# Altium project Inteligent_IGBT.PrjPcb
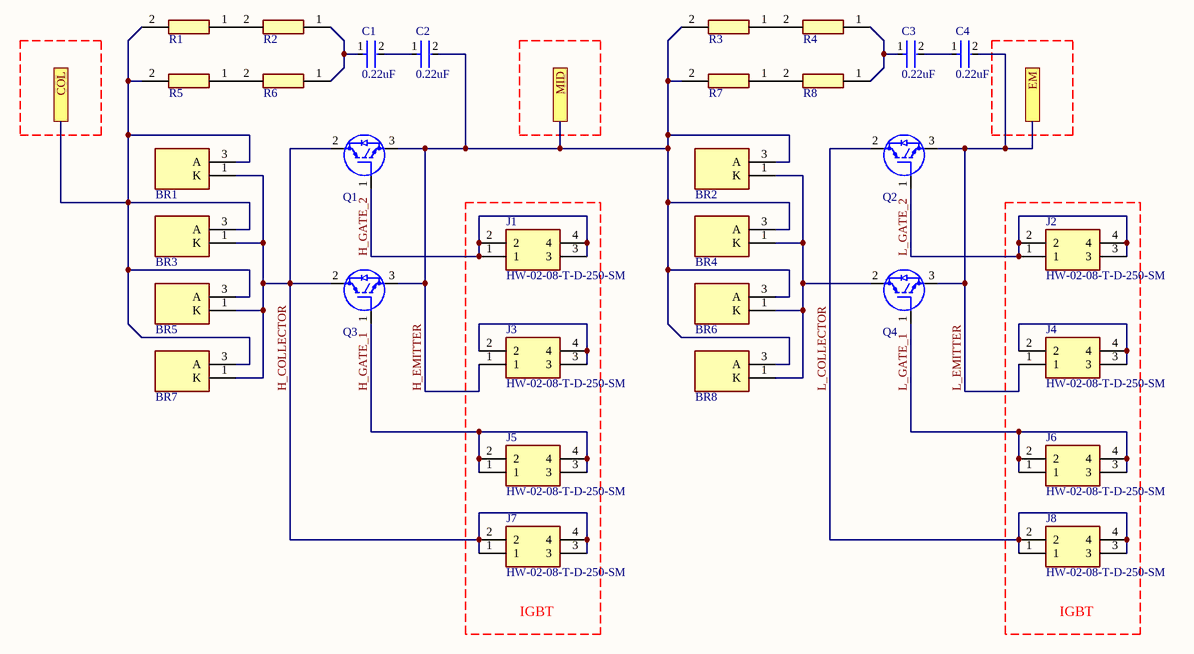
[diagram p0: Inteligent_IGBT.SchDoc]
1 sheet, 32 parts. Net scope: flat (ports and power ports of the same name join across sheets).
Board file: Inteligent_IGBT.PcbDoc

## Sheet Inteligent_IGBT.SchDoc
size A4

### Parts
BR1  VS-75EPU12L-N3  [VS-75EPU12L-N3]  (value not drawn)
BR2  VS-75EPU12L-N3  [VS-75EPU12L-N3]  (value not drawn)
BR3  VS-75EPU12L-N3  [VS-75EPU12L-N3]  (value not drawn)
BR4  VS-75EPU12L-N3  [VS-75EPU12L-N3]  (value not drawn)
BR5  VS-75EPU12L-N3  [VS-75EPU12L-N3]  (value not drawn)
BR6  VS-75EPU12L-N3  [VS-75EPU12L-N3]  (value not drawn)
BR7  VS-75EPU12L-N3  [VS-75EPU12L-N3]  (value not drawn)
BR8  VS-75EPU12L-N3  [VS-75EPU12L-N3]  (value not drawn)
C1  0.22uF  [FP-CKC33C-IPC_A]
C2  0.22uF  [FP-CKC33C-IPC_A]
C3  0.22uF  [FP-CKC33C-IPC_A]
C4  0.22uF  [FP-CKC33C-IPC_A]
J1  HW-02-08-T-D-250-SM  [HW0208TD250SM]
J2  HW-02-08-T-D-250-SM  [HW0208TD250SM]
J3  HW-02-08-T-D-250-SM  [HW0208TD250SM]
J4  HW-02-08-T-D-250-SM  [HW0208TD250SM]
J5  HW-02-08-T-D-250-SM  [HW0208TD250SM]
J6  HW-02-08-T-D-250-SM  [HW0208TD250SM]
J7  HW-02-08-T-D-250-SM  [HW0208TD250SM]
J8  HW-02-08-T-D-250-SM  [HW0208TD250SM]
Q1  IXYK110N120A4  [IXYK110N120A4]  (value not drawn)
Q2  IXYK110N120A4  [IXYK110N120A4]  (value not drawn)
Q3  IXYK110N120A4  [IXYK110N120A4]  (value not drawn)
Q4  IXYK110N120A4  [IXYK110N120A4]  (value not drawn)
R1  RCL12251K00FKEG  [RESC3263X80N]  (value not drawn)
R2  RCL12251K00FKEG  [RESC3263X80N]  (value not drawn)
R3  RCL12251K00FKEG  [RESC3263X80N]  (value not drawn)
R4  RCL12251K00FKEG  [RESC3263X80N]  (value not drawn)
R5  RCL12251K00FKEG  [RESC3263X80N]  (value not drawn)
R6  RCL12251K00FKEG  [RESC3263X80N]  (value not drawn)
R7  RCL12251K00FKEG  [RESC3263X80N]  (value not drawn)
R8  RCL12251K00FKEG  [RESC3263X80N]  (value not drawn)

### Blocks framed on the sheet
IGBT: J1 J3 J5 J7
IGBT: J2 J4 J6 J8

### Ports
COL, EM, MID

### Nets
H_COLLECTOR: BR1.1(K) BR3.1(K) BR5.1(K) BR7.1(K) J7.1 J7.2 J7.3 J7.4 Q1.2(C) Q3.2(C)
H_EMITTER: BR2.3(A) BR4.3(A) BR6.3(A) BR8.3(A) C2.2 J3.1 Q1.3(E) Q3.3(E) R3.2 R7.2 ; port MID
H_GATE_1: J5.1 J5.2 J5.3 J5.4 Q3.1(G)
H_GATE_2: J1.1 J1.2 J1.3 J1.4 Q1.1(G)
L_COLLECTOR: J8.1 J8.2 J8.3 J8.4 Q2.2(C)
L_EMITTER: C4.2 J4.1 Q2.3(E) Q4.3(E) ; port EM
L_GATE_1: J6.1 J6.2 J6.3 J6.4 Q4.1(G)
L_GATE_2: J2.1 J2.2 J2.3 J2.4 Q2.1(G)
NetBR1_3: BR1.3(A) BR3.3(A) BR5.3(A) BR7.3(A) R1.2 R5.2 ; port COL
NetBR2_1: BR2.1(K) BR4.1(K) BR6.1(K) BR8.1(K) Q4.2(C)
NetC1_1: C1.1 R2.1 R6.1
NetC1_2: C1.2 C2.1
NetC3_1: C3.1 R4.1 R8.1
NetC3_2: C3.2 C4.1
NetJ3_2: J3.2 J3.3 J3.4
NetJ4_2: J4.2 J4.3 J4.4
NetR1_1: R1.1 R2.2
NetR3_1: R3.1 R4.2
NetR5_1: R5.1 R6.2
NetR7_1: R7.1 R8.2

### Library data of the parts
BR1-BR8 = VS-75EPU12L-N3: Bridge Rectifier; Manufacturer_Name: Vishay; Datasheet Link: https://datasheet.lcsc.com/szlcsc/1811271814_Vishay-Intertech-VS-75EPU12L-N3_C335787.pdf; Height: 24.99mm; Manufacturer_Part_Number: VS-75EPU12L-N3; Mouser Part Number: 78-VS-75EPU12L-N3; Mouser Price/Stock: https://www.mouser.co.uk/ProductDetail/Vishay-Semiconductors/VS-75EPU12L-N3?qs=AfeIN4OqR0CECNyPZBJseQ%3D%3D; Arrow Part Number: VS-75EPU12L-N3; Arrow Price/Stock: https://www.arrow.com/en/products/vs-75epu12l-n3/vishay
C1-C4 = CMP-03020-010018-1: KC-LINK 3640 220NF 500V C0G; Manufacturer: KEMET; Manufacturer Part Number: CKC33C224KCGACAUTO; Material: Ceramic; Automotive Grade: Grade 0; Temperature Coefficient: 30ppm/°C; Tolerance: 0.1; RoHS: TRUE; ComponentLink2Description: Datasheet; Category: Cap; Temperature Range High: +150°C; Value: 0.22 uF; Ipc Land Pattern Name: CAPC9301020X250; Height: 2.7mm; Temperature Characteristic: C0G; Automotive: Yes; Device Class L1: Passive Components; Digikey Description: KC-LINK 3640 220NF 500V C0G; Temperature Range Low: -55°C; Lead Free: Yes; Device Class L2: Capacitors; ComponentLink2URL: https://content.kemet.com/datasheets/KEM_C1039_KC-LINK_C0G.pdf; Octopart: https://octopart.com/ckc33c224kcgacauto-kemet-88954723; Mouser Description: Cap Ceramic 0.22uF 500V C0G 10% Pad SMD 3640 150C Automotive T/R; Voltage Rating: 500V; Temperature: -55°C to +150°C; Device Class L3: Ceramic Capacitors; Package: CKC33C; Capacitance: 0.22 uF
J1-J8 = HW-02-08-T-D-250-SM: Connector; Manufacturer_Name: SAMTEC; Datasheet Link: https://suddendocs.samtec.com/catalog_english/hw_sm.pdf; Height: 12.06mm; Manufacturer_Part_Number: HW-02-08-T-D-250-SM; Mouser Part Number: 200-HW0208TD250SM; Mouser Price/Stock: https://www.mouser.com/Search/Refine.aspx?Keyword=200-HW0208TD250SM; System: Connector
Q1-Q4 = IXYK110N120A4: Transistor IGBT; Manufacturer_Name: IXYS SEMICONDUCTOR; Datasheet Link: https://www.littelfuse.com/~/media/electronics/datasheets/discrete_igbts/littelfuse_discrete_igbts_xpt_ixyk110n120a4_datasheet.pdf.pdf; Height: 5.31mm; Manufacturer_Part_Number: IXYK110N120A4
R1-R8 = RCL12251K00FKEG: Resistor; Manufacturer_Name: Vishay; Datasheet Link: https://www.mouser.com/datasheet/2/427/rcle3-247384.pdf; Height: 0.8mm; Manufacturer_Part_Number: RCL12251K00FKEG; Mouser Part Number: 71-RCL12251K00FKEG; Mouser Price/Stock: https://www.mouser.com/Search/Refine.aspx?Keyword=71-RCL12251K00FKEG